# Altium schematic sheet Sheet2.SchDoc
size A; SheetNumber: 5; SheetTotal: 5
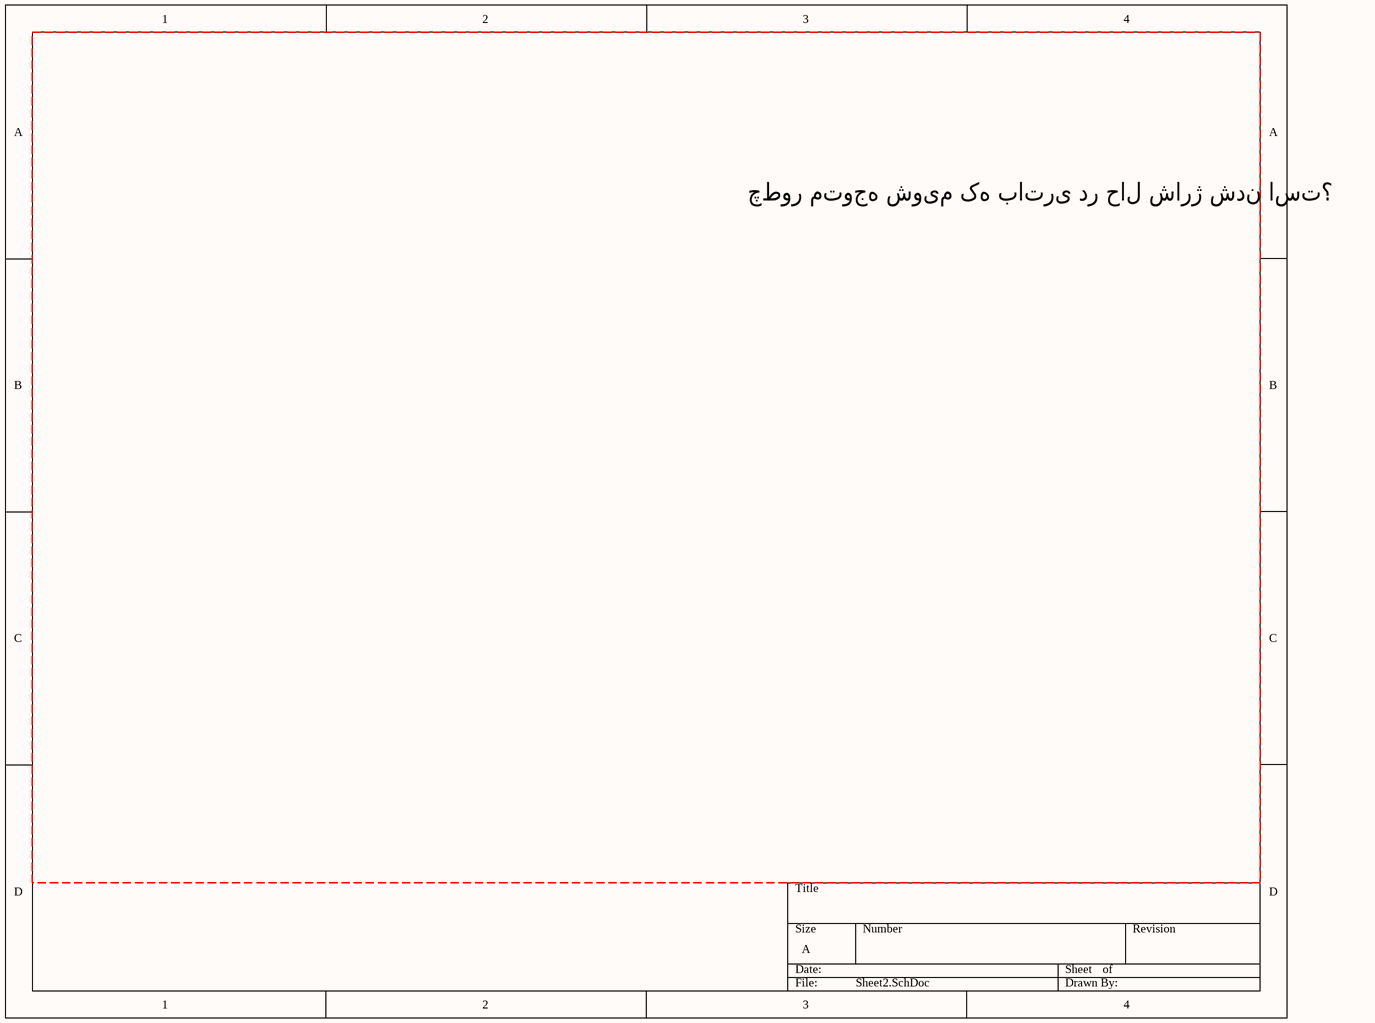
[diagram p0: Sheet2.SchDoc]

## Notes on the sheet
- چطور متوجه شویم که باتری در حال شارژ شدن است؟